# EAGLE schematic LOGICA NAO (EAGLE 9.5.2)
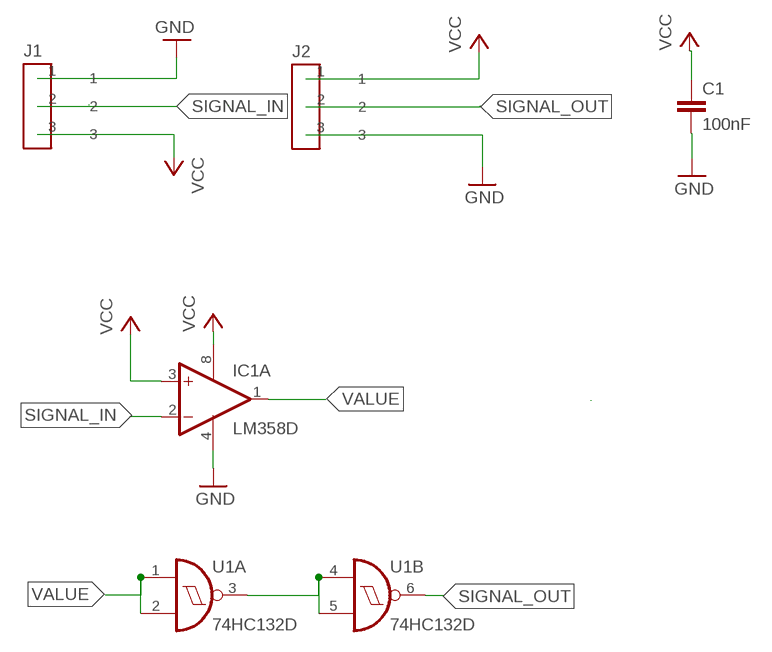
[diagram p0: schematic, sheet 1]

## Parts
C1  100nF  C-EUC0805  [C0805]
IC1  LM358D  [SO08]
J1  CONECTOR_MACHO  [3CONECTOR]
J2  CONECTOR_FEMEA  [3CONECTOR]
U1  74HC132D  [SO14]

## Nets
GND: C1.2 IC1.4(P:V-) J1.1 J2.3
N$4: U1.3(A:O) U1.4(B:I0) U1.5(B:I1)
SIGNAL_IN: IC1.2(A:-IN) J1.2
SIGNAL_OUT: J2.2 U1.6(B:O)
VALUE: IC1.1(A:OUT) U1.1(A:I0) U1.2(A:I1)
VCC: C1.1 IC1.3(A:+IN) IC1.8(P:V+) J1.3 J2.1
Unconnected: IC1.5(B:+IN) IC1.6(B:-IN) IC1.7(B:OUT) U1.8(C:O) U1.9(C:I0) U1.10(C:I1) U1.11(D:O) U1.12(D:I0) U1.13(D:I1)

## Power pins joined to a net without a drawn wire
GND: U1.7(P:GND)
VCC: U1.14(P:VCC)

## Library data of the parts
C1 = rcl:C-EU: CAPACITOR, European symbol; SPICEPREFIX: C
IC1 = linear:LM358: OP AMP also LM158; LM258; LM2904 Source: http://cache.national.com/ds/LM/LM158.pdf
J1 = Eletroblocks Lib:CONECTOR_MACHO
J2 = Eletroblocks Lib:CONECTOR_FEMEA
U1 = 74xx-eu:74*132: Quad 2-input NAND schmitt trigger